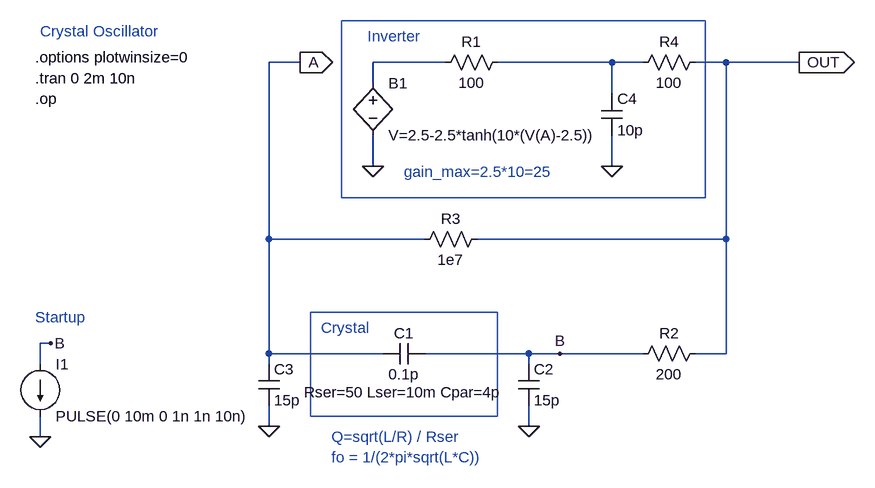
[diagram p0: schematic Crystal_oscillator.asc]
Crystal_oscillator.asc, the LTspice schematic file:
Version 4
SHEET 1 880 716
WIRE -16 96 -64 96
WIRE 208 96 96 96
WIRE 464 96 288 96
WIRE 512 96 464 96
WIRE 640 96 592 96
WIRE 752 96 640 96
WIRE 96 128 96 96
WIRE 464 144 464 96
WIRE 96 256 96 208
WIRE 464 256 464 208
WIRE -64 368 -64 96
WIRE 176 368 -64 368
WIRE 640 368 640 96
WIRE 640 368 256 368
WIRE -400 528 -416 528
WIRE -64 544 -64 368
WIRE 112 544 -64 544
WIRE 336 544 176 544
WIRE 384 544 336 544
WIRE 512 544 384 544
WIRE 640 544 640 368
WIRE 640 544 592 544
WIRE -416 560 -416 528
WIRE -64 560 -64 544
WIRE 336 560 336 544
WIRE -64 656 -64 624
WIRE 336 656 336 624
WIRE -416 672 -416 640
FLAG 96 256 0
FLAG -16 96 A
IOPIN -16 96 Out
FLAG -64 656 0
FLAG 336 656 0
FLAG -416 672 0
FLAG -400 528 B
FLAG 384 544 B
FLAG 464 256 0
FLAG 752 96 OUT
IOPIN 752 96 Out
SYMBOL bv 96 112 R0
SYMATTR InstName B1
SYMATTR Value V=2.5-2.5*tanh(10*(V(A)-2.5))
SYMBOL res 192 112 R270
WINDOW 0 32 56 VTop 0
WINDOW 3 0 56 VBottom 0
SYMATTR InstName R1
SYMATTR Value 100
SYMBOL cap 112 560 R270
WINDOW 0 32 32 VTop 0
WINDOW 3 0 32 VBottom 0
WINDOW 39 -28 32 VBottom 0
SYMATTR InstName C1
SYMATTR Value 0.1p
SYMATTR SpiceLine Rser=50 Lser=10m Cpar=4p
SYMBOL cap 320 560 R0
SYMATTR InstName C2
SYMATTR Value 15p
SYMBOL cap -80 560 R0
SYMATTR InstName C3
SYMATTR Value 15p
SYMBOL res 608 528 R90
WINDOW 0 0 56 VBottom 0
WINDOW 3 32 56 VTop 0
SYMATTR InstName R2
SYMATTR Value 200
SYMBOL current -416 560 R0
WINDOW 123 0 0 Left 0
WINDOW 39 0 0 Left 0
SYMATTR InstName I1
SYMATTR Value PULSE(0 10m 0 1n 1n 10n)
SYMBOL res 160 384 R270
WINDOW 0 32 56 VTop 0
WINDOW 3 0 56 VBottom 0
SYMATTR InstName R3
SYMATTR Value 1e7
SYMBOL cap 448 144 R0
SYMATTR InstName C4
SYMATTR Value 10p
SYMBOL res 496 112 R270
WINDOW 0 32 56 VTop 0
WINDOW 3 0 56 VBottom 0
SYMATTR InstName R4
SYMATTR Value 100
TEXT -424 120 Left 0 !.tran 0 2m 10n
TEXT -424 152 Left 0 !.op
TEXT 88 56 Left 0 ;Inverter
TEXT 16 504 Left 0 ;Crystal
TEXT -424 488 Left 0 ;Startup
TEXT -416 48 Left 0 ;Crystal Oscillator
TEXT -424 88 Left 0 !.options plotwinsize=0
TEXT 32 672 Left 0 ;Q=sqrt(L/R) / Rser\nfo = 1/(2*pi*sqrt(L*C))
TEXT 144 264 Left 0 ;gain_max=2.5*10=25
RECTANGLE Normal 608 304 48 32
RECTANGLE Normal 288 640 0 480

The netlist it stands for:
* Crystal_oscillator.asc
B1 N001 0 V=2.5-2.5*tanh(10*(V(A)-2.5))
R1 N001 N002 100
C1 A B 0.1p Rser=50 Lser=10m Cpar=4p
C2 B 0 15p
C3 A 0 15p
R2 OUT B 200
I1 B 0 PULSE(0 10m 0 1n 1n 10n)
R3 A OUT 1e7
C4 N002 0 10p
R4 N002 OUT 100
.tran 0 2m 10n
.op
* Inverter
* Crystal
* Startup
* Crystal Oscillator
.options plotwinsize=0
* Q=sqrt(L/R) / Rser
* fo = 1/(2*pi*sqrt(L*C))
* gain_max=2.5*10=25
.backanno
.end